# Altium schematic sheet Sheet1.SCHDOC
size 420 x 297 mm; SheetNumber: 1; SheetTotal: 1; DocumentName: Sheet1.SCHDOC
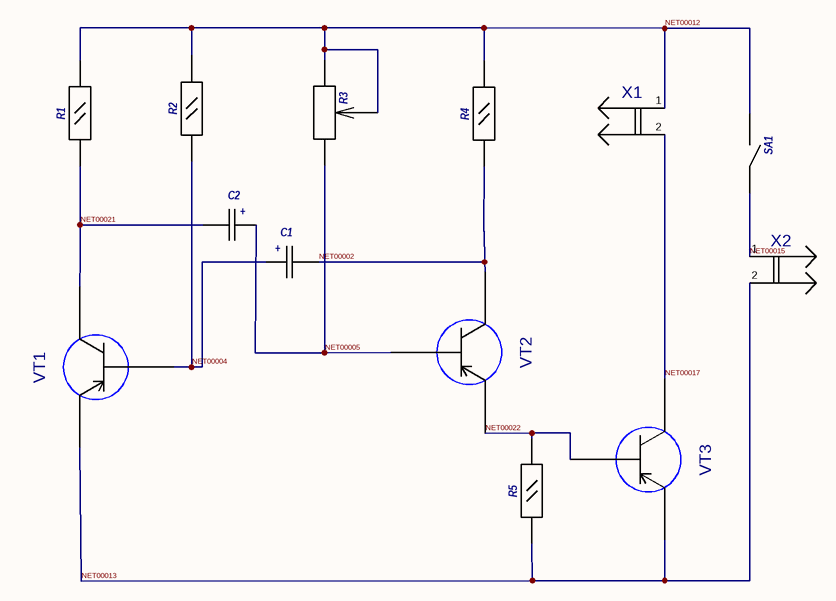
[diagram p0: Sheet1.SCHDOC]

## Parts
C1  K50-29 (1;2,2;4,7;10;22 MK)  [К50-29 (17Х6)]  (value not drawn)
C2  K50-29 (1;2,2;4,7;10;22 MK)  [К50-29 (17Х6)]  (value not drawn)
R1  МЛТ(0.125)  [МЛТ(0.125)]  (value not drawn)
R2  МЛТ(0.125)  [МЛТ(0.125)]  (value not drawn)
R3  СП3-38В  [СП3-38В]  (value not drawn)
R4  МЛТ(0.125)  [МЛТ(0.125)]  (value not drawn)
R5  МЛТ(0.125)  [МЛТ(0.125)]  (value not drawn)
SA1  T1  [Т1]  (value not drawn)
VT1  КТ837  [КТ837]  (value not drawn)
VT2  КТ837  [КТ837]  (value not drawn)
VT3  КТ837  [КТ837]  (value not drawn)
X1  2XR  [2XR]  (value not drawn)
X2  2XR  [2XR]  (value not drawn)

## Nets
NET00002: C1.1 R4.1 VT2.2(A2)
NET00004: C1.2 R2.1 VT1.1(A1)
NET00005: C2.2 R3.1 VT2.1(A1)
NET00012: R1.2 R2.2 R3.2 R3.3 R4.2 SA1.2 X1.1(I/O1)
NET00013: R5.1 VT1.3(A3) VT3.3(A3) X2.2(I/O2)
NET00015: SA1.1 X2.1(I/O1)
NET00017: VT3.2(A2) X1.2(I/O2)
NET00021: C2.1 R1.1 VT1.2(A2)
NET00022: R5.2 VT2.3(A3) VT3.1(A1)

## Notes on the sheet
- (in symbol K50-29 (1;2,2;4,7;10;22 MK)) +

## Library data of the parts
X1 X2 = 2XR: Value: *